# Altium schematic sheet GD_Tcontroller_Relay.SchDoc
size A3
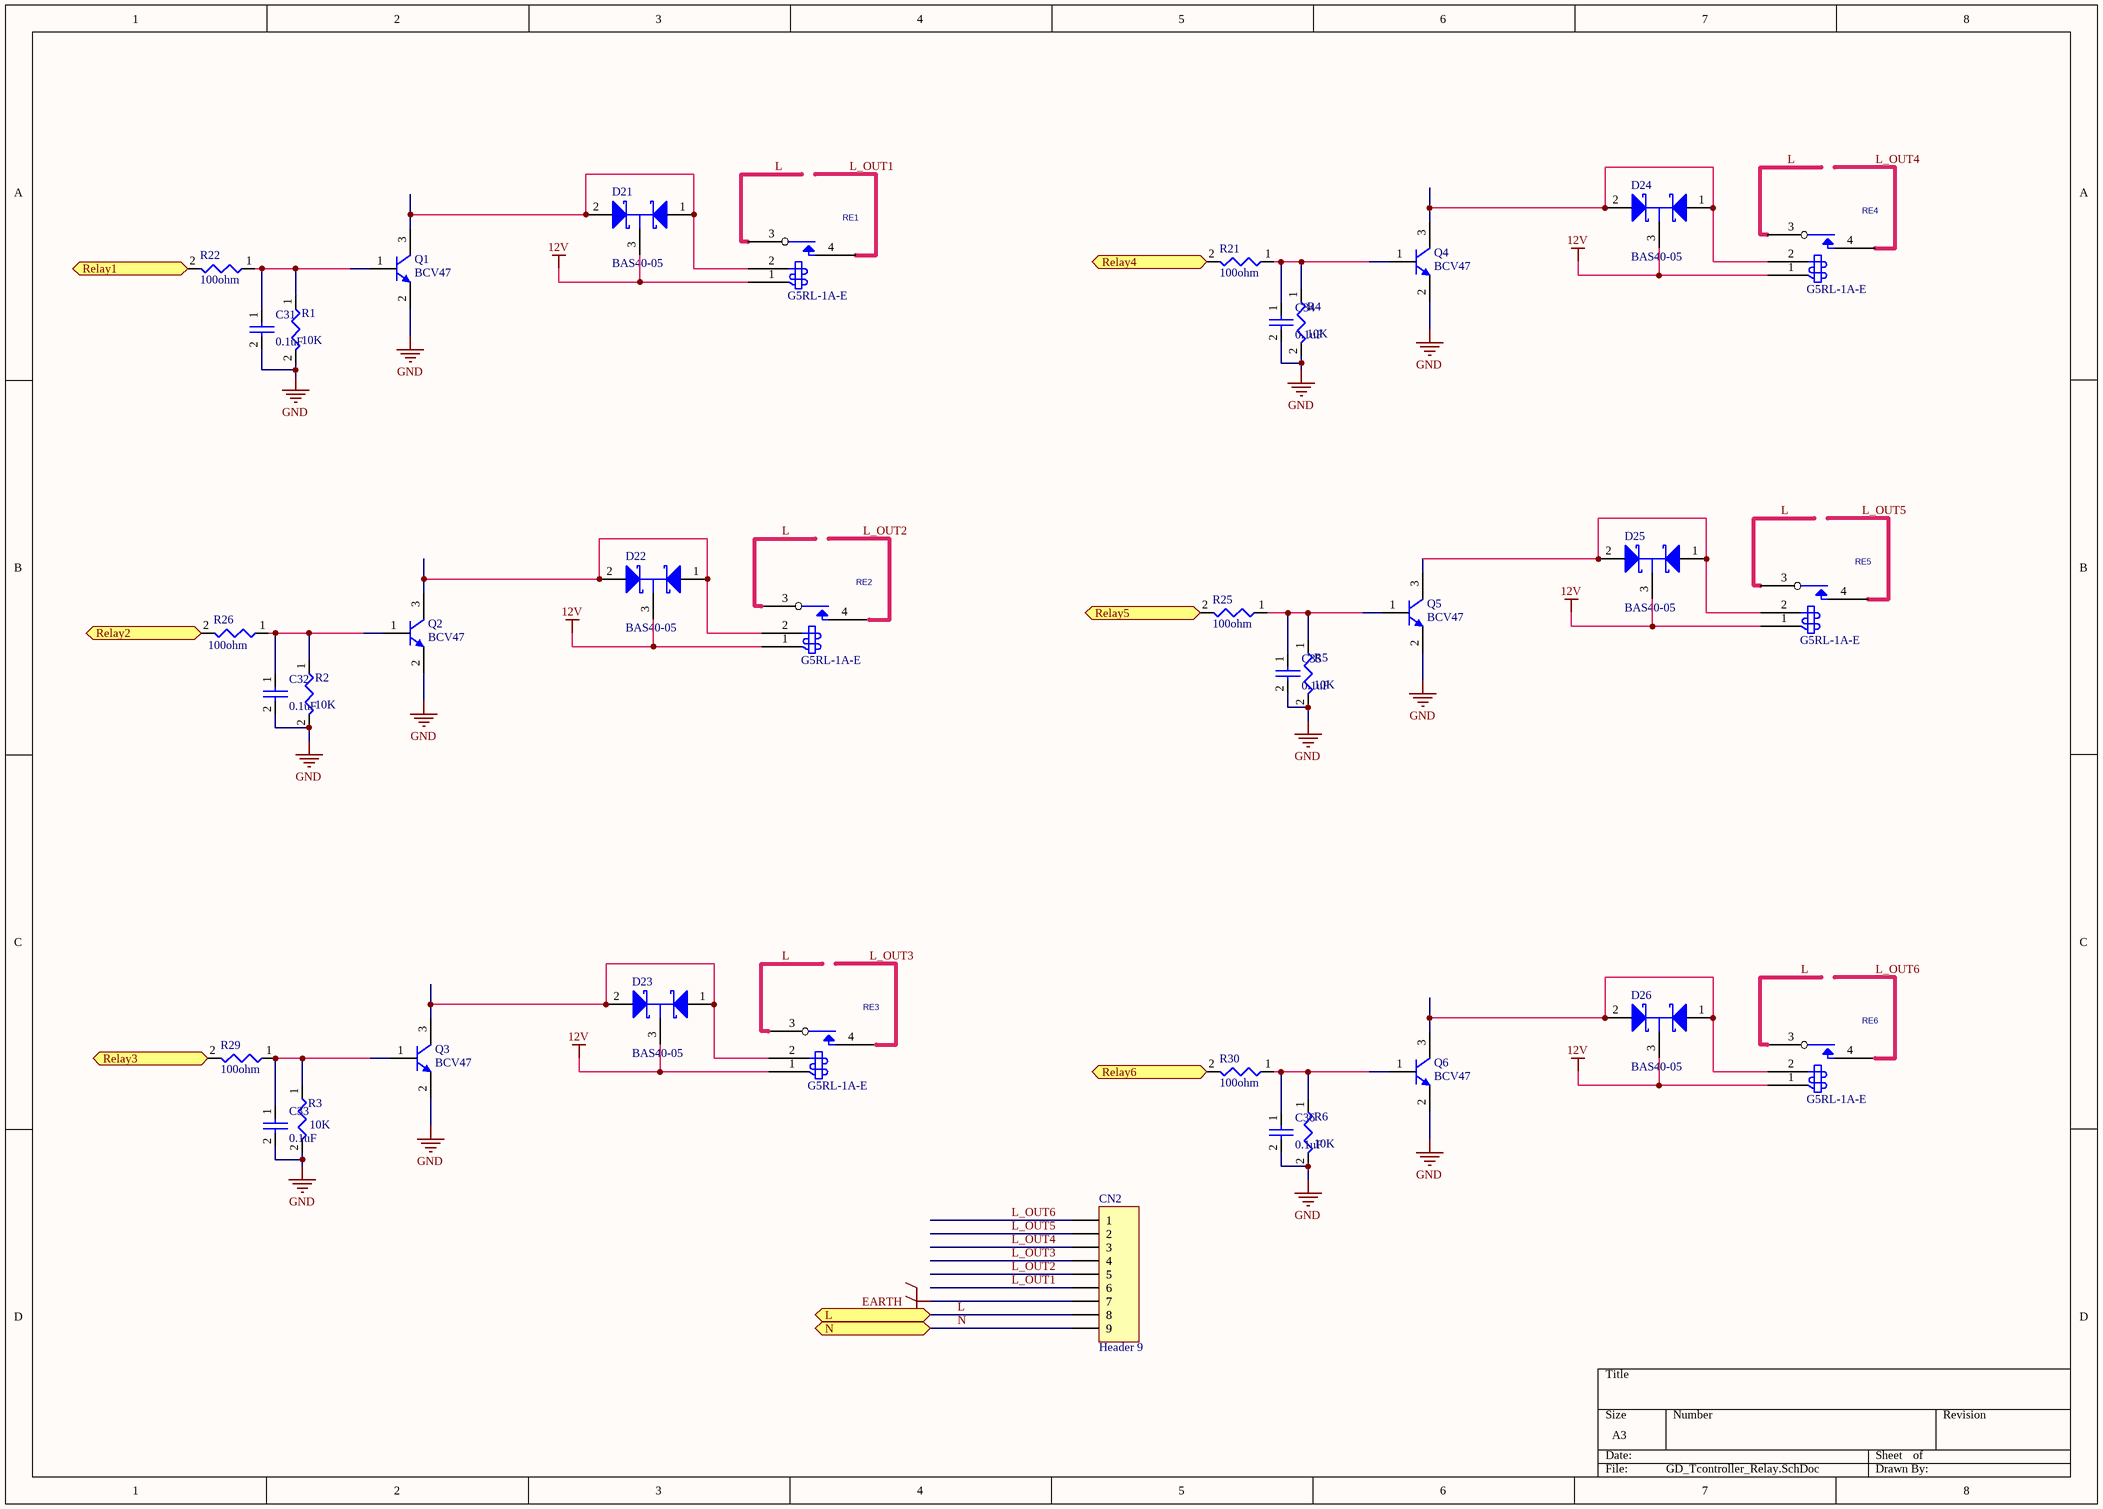
[diagram p0: GD_Tcontroller_Relay.SchDoc]

## Parts
C31  value 0.1uF  [C0805]  (hidden comment: CAP)
C32  value 0.1uF  [C0805]  (hidden comment: CAP)
C33  value 0.1uF  [C0805]  (hidden comment: CAP)
C34  value 0.1uF  [C0805]  (hidden comment: CAP)
C35  value 0.1uF  [C0805]  (hidden comment: CAP)
C36  value 0.1uF  [C0805]  (hidden comment: CAP)
CN2  Header 9  [KF7.62-9P]
D21  BAS40-05  [SOT23-123]
D22  BAS40-05  [SOT23-123]
D23  BAS40-05  [SOT23-123]
D24  BAS40-05  [SOT23-123]
D25  BAS40-05  [SOT23-123]
D26  BAS40-05  [SOT23-123]
Q1  BCV47  [INF-SOT23_L]
Q2  BCV47  [INF-SOT23_L]
Q3  BCV47  [INF-SOT23_L]
Q4  BCV47  [INF-SOT23_L]
Q5  BCV47  [INF-SOT23_L]
Q6  BCV47  [INF-SOT23_L]
R1  value 10K  [R0805]
R2  value 10K  [R0805]
R3  value 10K  [R0805]
R4  value 10K  [R0805]
R5  value 10K  [R0805]
R6  value 10K  [R0805]
R21  value 100ohm  [R0805]  (hidden comment: RES)
R22  value 100ohm  [R0805]  (hidden comment: RES)
R25  value 100ohm  [R0805]  (hidden comment: RES)
R26  value 100ohm  [R0805]  (hidden comment: RES)
R29  value 100ohm  [R0805]  (hidden comment: RES)
R30  value 100ohm  [R0805]  (hidden comment: RES)
RE1  RELAY SP  [G5RL-1A-E]  (value not drawn)
RE2  RELAY SP  [G5RL-1A-E]  (value not drawn)
RE3  RELAY SP  [G5RL-1A-E]  (value not drawn)
RE4  RELAY SP  [G5RL-1A-E]  (value not drawn)
RE5  RELAY SP  [G5RL-1A-E]  (value not drawn)
RE6  RELAY SP  [G5RL-1A-E]  (value not drawn)

## Ports
L, N, Relay1, Relay2, Relay3, Relay4, Relay5, Relay6

## Nets
12V: D21.3(C) D22.3(C) D23.3(C) D24.3(C) D25.3(C) D26.3(C) RE1.1(COIL) RE2.1(COIL) RE3.1(COIL) RE4.1(COIL) RE5.1(COIL) RE6.1(COIL)
EARTH: CN2.7
GND: C31.2 C32.2 C33.2 C34.2 C35.2 C36.2 Q1.2(E) Q2.2(E) Q3.2(E) Q4.2(E) Q5.2(E) Q6.2(E) R1.2 R2.2 R3.2 R4.2 R5.2 R6.2
L: CN2.8 RE1.3(COMMON) RE2.3(COMMON) RE3.3(COMMON) RE4.3(COMMON) RE5.3(COMMON) RE6.3(COMMON) ; port L
L_OUT1: CN2.6 RE1.4(NO)
L_OUT2: CN2.5 RE2.4(NO)
L_OUT3: CN2.4 RE3.4(NO)
L_OUT4: CN2.3 RE4.4(NO)
L_OUT5: CN2.2 RE5.4(NO)
L_OUT6: CN2.1 RE6.4(NO)
N: CN2.9 ; port N
Relay1: R22.2 ; port Relay1
Relay2: R26.2 ; port Relay2
Relay3: R29.2 ; port Relay3
Relay4: R21.2 ; port Relay4
Relay5: R25.2 ; port Relay5
Relay6: R30.2 ; port Relay6
NetC31_1: C31.1 Q1.1(B) R1.1 R22.1
NetC32_1: C32.1 Q2.1(B) R2.1 R26.1
NetC33_1: C33.1 Q3.1(B) R3.1 R29.1
NetC34_1: C34.1 Q4.1(B) R4.1 R21.1
NetC35_1: C35.1 Q5.1(B) R5.1 R25.1
NetC36_1: C36.1 Q6.1(B) R6.1 R30.1
NetD21_1: D21.1(A) D21.2(K) Q1.3(C) RE1.2(COIL)
NetD22_1: D22.1(A) D22.2(K) Q2.3(C) RE2.2(COIL)
NetD23_1: D23.1(A) D23.2(K) Q3.3(C) RE3.2(COIL)
NetD24_1: D24.1(A) D24.2(K) Q4.3(C) RE4.2(COIL)
NetD25_1: D25.1(A) D25.2(K) Q5.3(C) RE5.2(COIL)
NetD26_1: D26.1(A) D26.2(K) Q6.3(C) RE6.2(COIL)

## Library data of the parts
C31-C36 = EC00014: CAP SMD CR X7R 50V 10% 0.1uF 0805 ROHS; Manufacturer: YAGEO; Manufacturer P/N: CC0805KRX7R9BB104; ID: 14; HelpURL: *; P/N: EC00014
CN2 = Header 9: Header, 9-Pin
D21-D26 = ED00044: DIODE Schottky Diode 40V 0.2A SOT-23 SMD ROHS; Manufacturer: NXP; ID: 44; Value: BAS40-05-V; Type: ****; HelpURL: \\192.168.1.3\Esh\Department\RD\CAD\Component\DIODE\BAS40_1PSXXSB4X_SER.pdf; P/N: ED00044; Manufacturer P/N: BAS40-05
Q1-Q6 = CMP-1196-00014-1: NPN Silicon Darlington Transistor, 60 V VCEO, 500 mA IC, SOT23, Reel, Green; Manufacturer: Infineon; fT (typ): 170 MHz; IC (max): 500 mA; ICBO (max): 10 uA; Green: TRUE; VCE: 5 V; hFE (min): 2000; ICM (max): 800 mA; VCBO (max): 80 V; IC: 100 mA; VCEO (max): 60 V; VEBO (max): 10 V; ComponentLink1URL: http://www.infineon.com/; PackageVersion: Apr-08; ComponentLink2URL: http://www.infineon.com/dgdl/bcv27_bcv47.pdf?folderId=db3a30431441fb5d011445c30f210183&fileId=db3a30431441fb5d011445cf7c3b0188; ComponentLink2Description: Datasheet; ComponentLink1Description: Manufacturer URL; PartNumber: BCV47; Polarity: NPN; PackageReference: SOT23; PackageDescription: 3-Pin Small Outline Transistor Package, 1.3 x 2.9 mm Body, 0.95 mm Pitch; ComponentLink3URL: http://www.infineon.com/dgdl/SOT23-Package_Overview.pdf?folderId=db3a30431936bc4b0119532290053c66&fileId=db3a30431936bc4b0119533468123c85; Mounting Technology: Surface Mount; Packing: Reel; ComponentLink3Description: Package Specification
R1-R6 = ER00213: RES THICK_FILM SMD 10K ohm 5% 1/10W ROHS 0603; Manufacturer: YAGEO; Manufacturer P/N: RC0603JR-1310KL; ID: 213; HelpURL: \\192.168.1.3\Esh\Department\RD\CAD\Component\Resistor\SMD\YAGEO_PYu-RC1206_51_RoHS_L_4.pdf; P/N: ER00213
R21 R22 R25 R26 R29 R30 = ER00035: RES THICK_FILM SMD 100 OHM 5% 1/8W ROHS 0805; Manufacturer: YAGEO; Manufacturer P/N: RC0805JR-07100RL; ID: 35; HelpURL: *; P/N: ER00035
RE1-RE6 = EK00005: Relay,12VDC,16A,250VAC; Manufacturer: OMRON; Value: Relay 16A; ID: 5; HelpURL: \\192.168.1.3\Esh\Department\RD\CAD\Component\relay\OMRON\G5RL_0609.pdf; P/N: EK00005; Manufacturer P/N: G5RL-1A-E; Type: *****